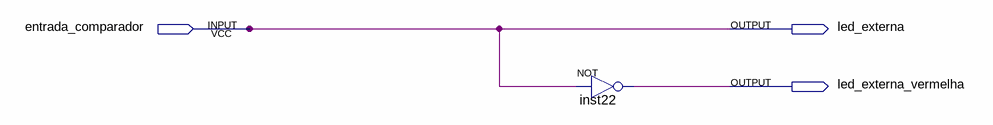
[diagram p0: schematic sheet]
// Quartus schematic leds_externas.bdf as structural Verilog: 1 symbols, 3 pins
module leds_externas (
  input  entrada_comparador,
  output led_externa,
  output led_externa_vermelha
);

  not inst22 (led_externa_vermelha, entrada_comparador);

  assign led_externa = entrada_comparador;
endmodule
